# EAGLE schematic MapGates (EAGLE 8.4.0)
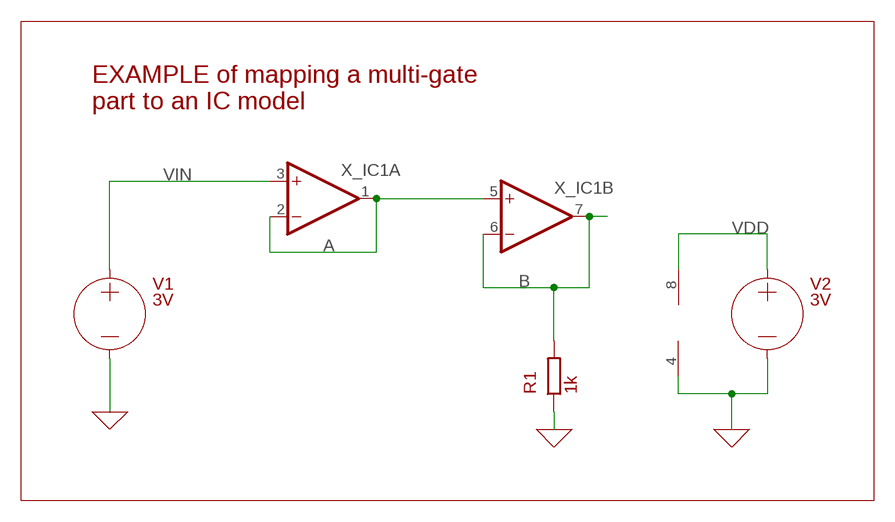
[diagram p0: schematic, sheet 1]

## Parts
R1  1k  R  (no package)
V1  3V  VOLTAGE  (no package)
V2  3V  VOLTAGE  (no package)
X_IC1  LM358D  [SO08]

## Nets
0: R1.1 V1.- V2.- X_IC1.4(P:V-) ; supply symbol labelled GND
A: X_IC1.1(A:OUT) X_IC1.2(A:-IN) X_IC1.5(B:+IN)
B: R1.2 X_IC1.6(B:-IN) X_IC1.7(B:OUT)
VDD: V2.+ X_IC1.8(P:V+)
VIN: V1.+ X_IC1.3(A:+IN)

## Notes on the sheet
- EXAMPLE of mapping a multi-gate 
  part to an IC model

## Library data of the parts
R1 = ngspice-simulation:R: RESISTOR
V1 V2 = ngspice-simulation:VOLTAGE: Independent Voltage Source, either DC, AC, PULSE, SINE, PWL, EXP, or SFFM; VALUE: 0V
X_IC1 = linear:LM358: OP AMP also LM158; LM258; LM2904 Source: http://cache.national.com/ds/LM/LM158.pdf; SPICEMODEL: LM358D; SPICEPREFIX: X